# Altium project c-mote.PrjPcb
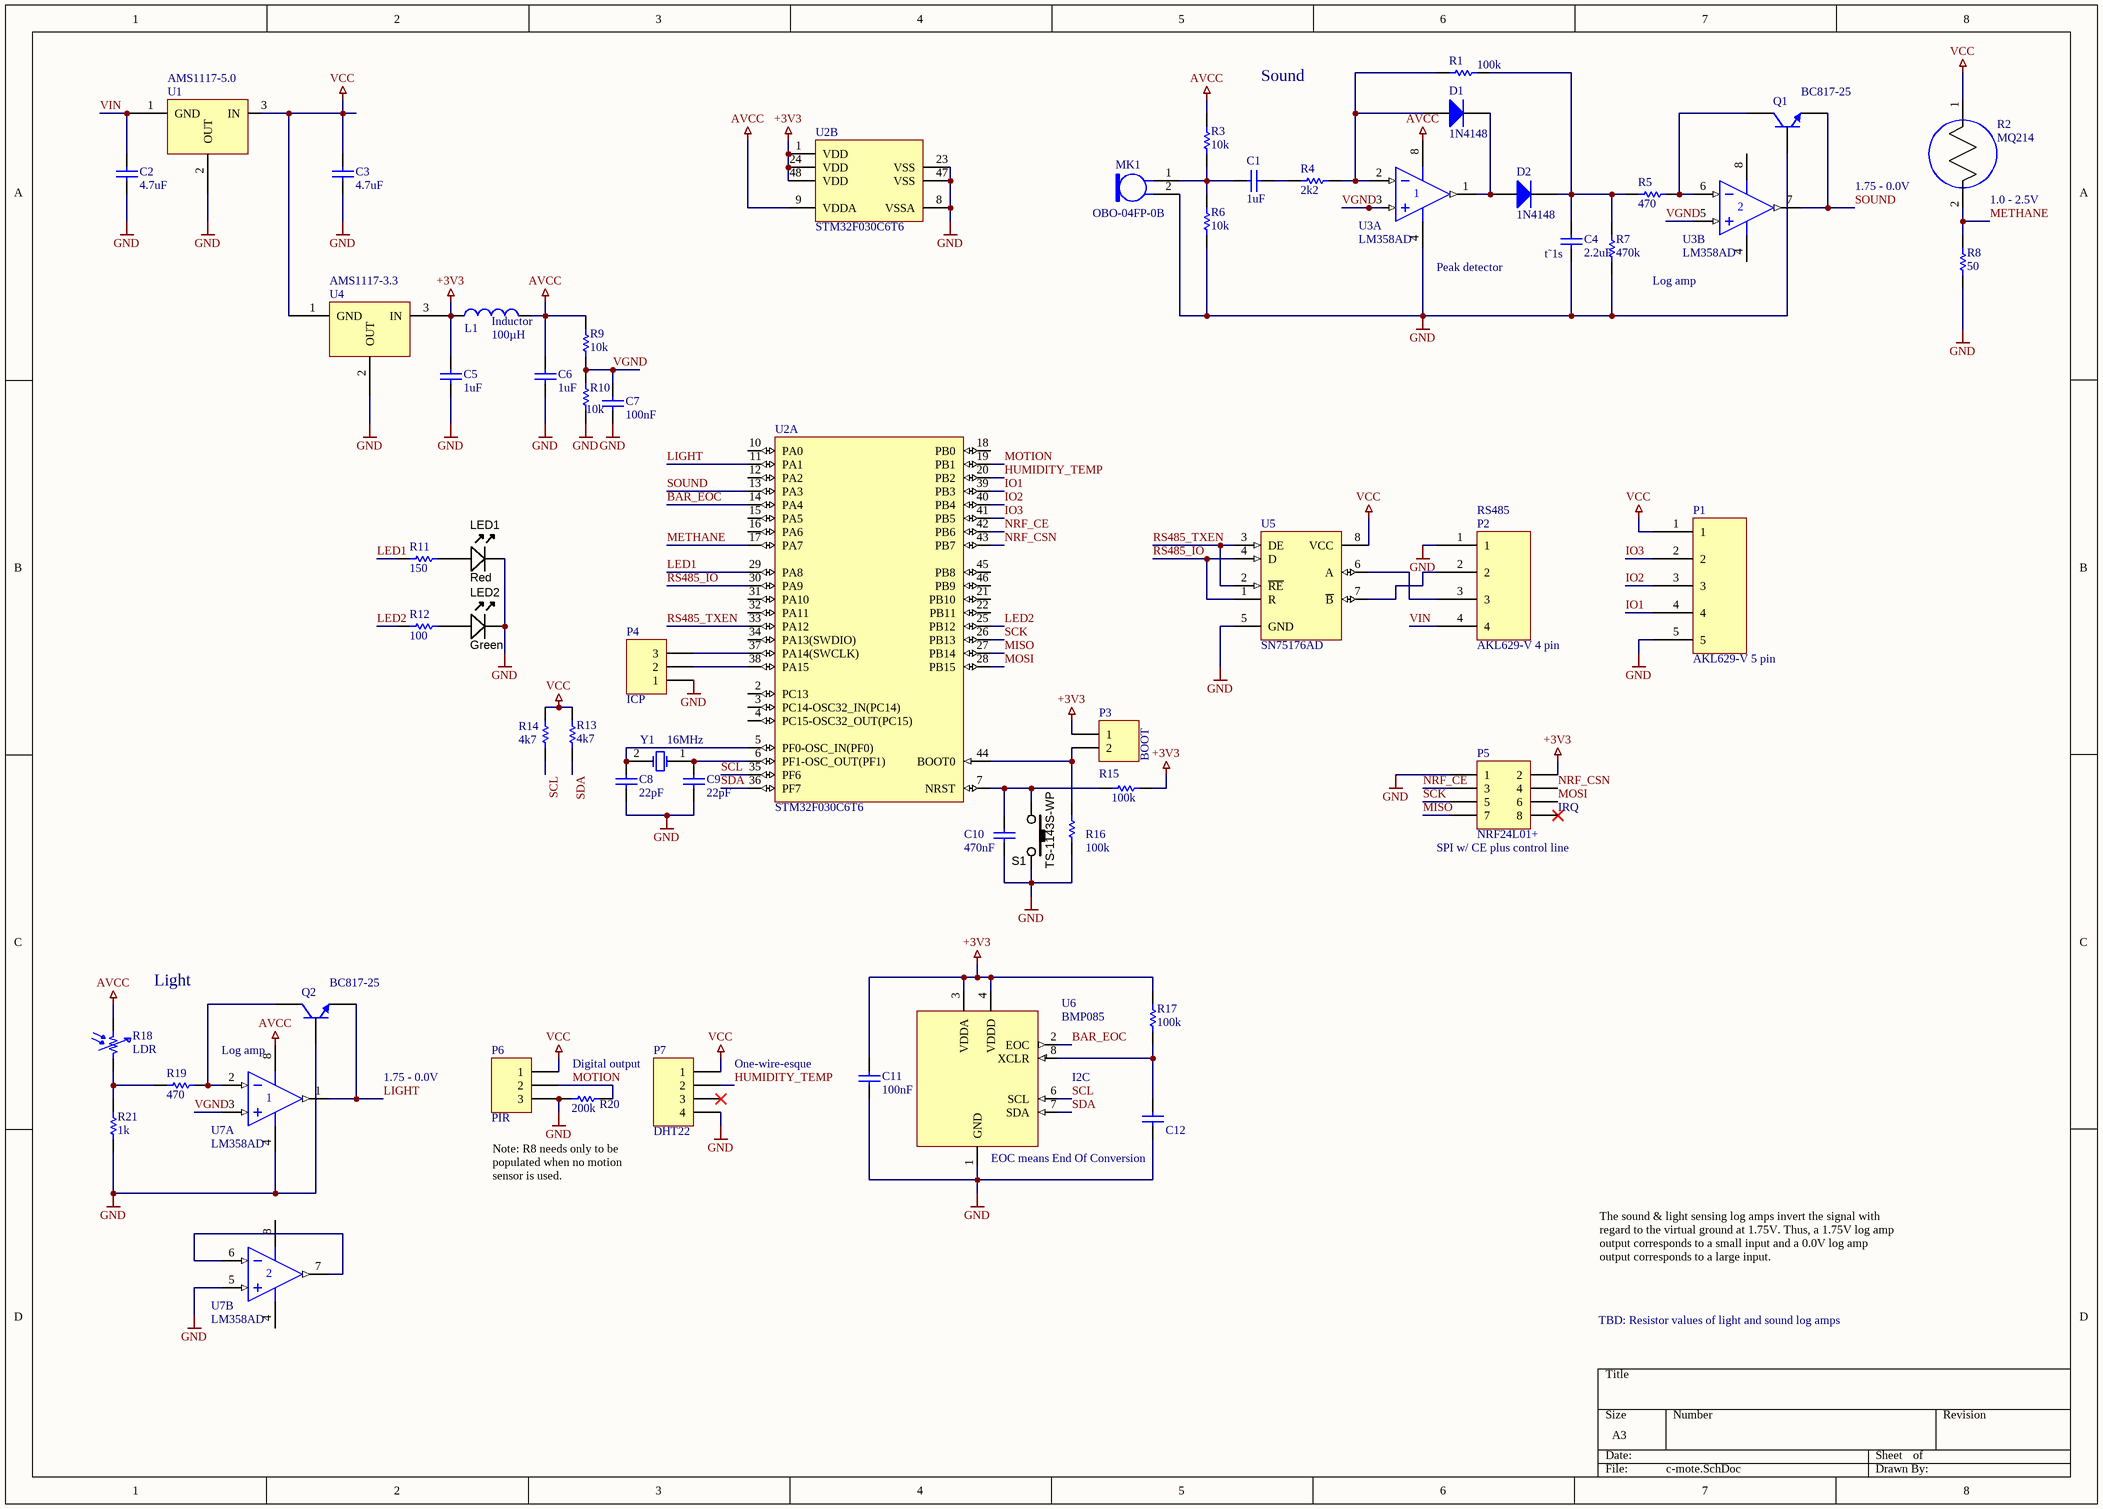
[diagram p0: c-mote.SchDoc]
1 sheet, 57 parts. Net scope: global (net labels, ports and power ports of the same name join across sheets).
Board file: c-mote.PcbDoc

## Sheet c-mote.SchDoc
size A3

### Parts
C1  value 1uF  [CAPC0805(2012)145_M]  (hidden comment: CAP 1uF 10V 0805(2012))
C2  value 4.7uF  [CAPC0805(2012)145_N]  (hidden comment: CAP 4.7uF 10V 0805(2012))
C3  value 4.7uF  [CAPC0805(2012)145_N]  (hidden comment: CAP 4.7uF 10V 0805(2012))
C4  value 2.2uF  [CAPC0805(2012)145_N]  (hidden comment: CAP 2.2uF 10V 0805(2012))
C5  value 1uF  [CAPC0805(2012)145_M]  (hidden comment: CAP 1uF 10V 0805(2012))
C6  value 1uF  [CAPC0805(2012)145_M]  (hidden comment: CAP 1uF 10V 0805(2012))
C7  value 100nF  [CAPC0805(2012)100_M]  (hidden comment: CAP 100nF 10V 0805(2012))
C8  value 22pF  [CAPC0805(2012)100_M]  (hidden comment: CAP 22pF 10V 0805(2012))
C9  value 22pF  [CAPC0805(2012)100_M]  (hidden comment: CAP 22pF 10V 0805(2012))
C10  value 470nF  [CAPC0805(2012)145_M]  (hidden comment: CAP 470nF 10V 0805(2012))
C11  value 100nF  [CAPC0805(2012)100_M]  (hidden comment: CAP 100nF 10V 0805(2012))
C12  CAP 10nF 10V 0805(2012)  [CAPC0805(2012)100_L]  (value not drawn)
D1  1N4148  [SOD-323F]
D2  1N4148  [SOD-323F]
L1  Inductor  value 100µH  [INDC3216]
LED1  Color: Red  [LED-0805-K]
LED2  Color: Green  [LED-0805-K]
MK1  OBO-04FP-0B  [OBO-04FP-0B]
P1  AKL629-V 5 pin
P2  AKL629-V 4 pin
P3  BOOT  [HDR1X2]
P4  ICP  [HDR1X3]
P5  NRF24L01+  [HDR2X4]
P6  PIR  [China-PIR sensor]
P7  DHT22  [DHT22-H]
Q1  BC817-25  [SOT23_N]
Q2  BC817-25  [SOT23_N]
R1  100k  [6-0805]
R2  MQ214  [MQ214]
R3  10k  [6-0805]
R4  2k2  [6-0805]
R5  470  [6-0805]
R6  10k  [6-0805]
R7  470k  [6-0805]
R8  50  [6-0805]
R9  10k  [6-0805]
R10  10k  [6-0805]
R11  150  [6-0805]
R12  100  [6-0805]
R13  4k7  [6-0805]
R14  4k7  [6-0805]
R15  100k  [6-0805]
R16  100k  [6-0805]
R17  100k  [6-0805]
R18  LDR  [KE-10720]
R19  470  [6-0805]
R20  200k  [6-0805]
R21  1k  [6-0805]
S1  TS-1143S-WP  [TS-1143S]
U1  AMS1117-5.0  [SOT223]
U2  STM32F030C6T6  [STM-LQFP48_N]  (parts A,B of 2)
U3  LM358AD  [SOIC127P600X175-8AN]  (parts A,B of 2)
U4  AMS1117-3.3  [SOT223]
U5  SN75176AD  [SOIC127P600X175-8AN]
U6  BMP085  [BMP085]
U7  LM358AD  [SOIC127P600X175-8AN]  (parts A,B of 2)
Y1  16MHz  [HC49/US]

### Nets
+3V3: C5.2 C11.2 L1.1 P3.1 P5.2 R15.2 R17.2 U2.1(VDD) U2.24(VDD) U2.48(VDD) U4.3(IN) U6.3(VDDA) U6.4(VDDD)
AVCC: C6.2 L1.2 R3.2 R9.2 R18.1 U2.9(VDDA) U3.8(V+) U7.8(V+)
GND: C2.1 C3.1 C4.1 C5.1 C6.1 C7.1 C8.1 C9.1 C10.1 C11.1 C12.1 LED1.K LED2.K MK1.2 P1.5 P2.1 P4.1 P5.1 P6.3 P7.4 Q1.1(B) Q2.1(B) R6.1 R7.2 R8.1 R10.1 R16.1 R20.1 R21.2 S1.2 U1.2(OUT) U2.8(VSSA) U2.23(VSS) U2.47(VSS) U3.4(V-) U4.2(OUT) U5.5(GND) U6.1(GND) U7.4(V-) U7.5(IN+)
VCC: C3.2 P1.1 P6.1 P7.1 R2.1 R13.1 R14.1 U1.3(IN) U4.1(GND) U5.8(VCC)
BAR_EOC: U2.14(PA4) U6.2(EOC)
HUMIDITY_TEMP: P7.2 U2.20(PB2)
IO1: P1.4 U2.39(PB3)
IO2: P1.3 U2.40(PB4)
IO3: P1.2 U2.41(PB5)
LED1: R11.2 U2.29(PA8)
LED2: R12.2 U2.25(PB12)
LIGHT: Q2.2(E) U2.11(PA1) U7.1(OUT)
METHANE: R2.2 R8.2 U2.17(PA7)
MISO: P5.7 U2.27(PB14)
MOSI: P5.6 U2.28(PB15)
MOTION: P6.2 R20.2 U2.19(PB1)
NRF_CE: P5.3 U2.42(PB6)
NRF_CSN: P5.4 U2.43(PB7)
RS485_IO: U2.30(PA9) U5.1(R) U5.4(D)
RS485_TXEN: U2.33(PA12) U5.2(~{RE}) U5.3(DE)
SCK: P5.5 U2.26(PB13)
SCL: R14.2 U2.35(PF6) U6.6(SCL)
SDA: R13.2 U2.36(PF7) U6.7(SDA)
SOUND: Q1.2(E) U2.13(PA3) U3.7(OUT)
VGND: C7.2 R9.1 R10.2 U3.3(IN+) U3.5(IN+) U7.3(IN+)
VIN: C2.2 P2.4 U1.1(GND)
NetC1_1: C1.1 R4.2
NetC1_2: C1.2 MK1.1 R3.1 R6.2
NetC4_2: C4.2 D2.2(K) R1.1 R5.1 R7.1
NetC8_2: C8.2 U2.5(PF0-OSC_IN(PF0)) Y1.2(OSC2)
NetC9_2: C9.2 U2.6(PF1-OSC_OUT(PF1)) Y1.1(OSC1)
NetC10_2: C10.2 R15.1 S1.1 U2.7(NRST)
NetC12_2: C12.2 R17.1 U6.8(XCLR)
NetD1_1: D1.1(A) R1.2 R4.1 U3.2(IN-)
NetD1_2: D1.2(K) D2.1(A) U3.1(OUT)
NetLED1_A: LED1.A R11.1
NetLED2_A: LED2.A R12.1
NetP2_2: P2.2 U5.7(~{B})
NetP2_3: P2.3 U5.6(A)
NetP3_2: P3.2 R16.2 U2.44(BOOT0)
NetP4_2: P4.2 U2.38(PA15)
NetP4_3: P4.3 U2.37(PA14(SWCLK))
NetQ1_3: Q1.3(C) R5.2 U3.6(IN-)
NetQ2_3: Q2.3(C) R19.2 U7.2(IN-)
NetR18_2: R18.2 R19.1 R21.1
NetU7_6: U7.6(IN-) U7.7(OUT)

Not connected (* = marked no-connect by the designer): P5 8*; P7 3*; U2 2(PC13) 3(PC14-OSC32_IN(PC14)) 4(PC15-OSC32_OUT(PC15)) 10(PA0) 12(PA2) 15(PA5) 16(PA6) 18(PB0) 21(PB10) 22(PB11) 31(PA10) 32(PA11) 34(PA13(SWDIO)) 45(PB8) 46(PB9)

### Notes on the sheet
- Sound
- (near R2) 1.75 - 0.0V
- (near R2) 1.0 - 2.5V
- Peak detector
- (near C4) t˜1s
- Log amp
- (near P2) RS485
- (near P5) SPI w/ CE plus control line
- (near P5) IRQ
- Light
- (near U7) Log amp
- 1.75 - 0.0V
- Digital output
- One-wire-esque
- (near U6) I2C
- (near U6) EOC means End Of Conversion
- Note: R8 needs only to be populated when no motion sensor is used.
- TBD: Resistor values of light and sound log amps
- The sound & light sensing log amps invert the signal with regard to the virtual ground at 1.75V. Thus, a 1.75V log amp output corresponds to a small input and a 0.0V log amp output corresponds to a large input.

### Library data of the parts
C1 C5 C6 = CMP-1036-04740-1: CAP 1uF 10V ±20% 0805 (2012 Metric) Thickness 1.45mm SMD; Case-Metric: 2012; Case-EIA: 0805; Technology: SMT; Rated Voltage: 10 V; Tolerance: ±20%; Max Thickness: 1.45 mm
C2 C3 = CMP-1036-04884-1: CAP 4.7uF 10V ±20% 0805 (2012 Metric) Thickness 1.45mm SMD; Case-EIA: 0805; Case-Metric: 2012; Rated Voltage: 10 V; Technology: SMT; Tolerance: ±20%; Max Thickness: 1.45 mm
C4 = CMP-1036-04824-1: CAP 2.2uF 10V ±10% 0805 (2012 Metric) Thickness 1.45mm SMD; Case-Metric: 2012; Case-EIA: 0805; Max Thickness: 1.45 mm; Tolerance: ±10%; Technology: SMT; Rated Voltage: 10 V
C7 C11 = CMP-1036-04394-1: CAP 100nF 10V ±10% 0805 (2012 Metric) Thickness 1mm SMD; Case-EIA: 0805; Case-Metric: 2012; Tolerance: ±10%; Max Thickness: 1 mm; Technology: SMT; Rated Voltage: 10 V
C8 C9 = CMP-1036-01210-1: CAP 22pF 10V ±5% 0805 (2012 Metric) Thickness 1mm SMD; Case-EIA: 0805; Case-Metric: 2012; Max Thickness: 1 mm; Rated Voltage: 10 V; Tolerance: ±5%; Technology: SMT
C10 = CMP-1036-04631-1: CAP 470nF 10V ±10% 0805 (2012 Metric) Thickness 1.45mm SMD; Case-EIA: 0805; Case-Metric: 2012; Max Thickness: 1.45 mm; Rated Voltage: 10 V; Technology: SMT; Tolerance: ±10%
C12 = CMP-1036-03809-1: CAP 10nF 10V ±10% 0805 (2012 Metric) Thickness 1mm SMD; Case-EIA: 0805; Case-Metric: 2012; Rated Voltage: 10 V; Tolerance: ±10%; Value: 10nF; Technology: SMT; Max Thickness: 1 mm
D1 D2 = 1N4148: High Conductance Fast Diode; Published: 8-Jun-2000; LatestRevisionDate: 17-Jul-2002; LatestRevisionNote: Re-released for DXP Platform.; DatasheetDocument: 1997; PackageReference: DO-35; Publisher: Altium Limited; Code_JEDEC: DO-204-AH; ComponentLink1Description: Manufacturer Link; ComponentLink1URL: http://www.fairchildsemi.com/; ComponentLink2Description: Datasheet; ComponentLink2URL: http://www.fairchildsemi.com/ds/1N%2F1N4148.pdf
L1 = Inductor: Code_IEC: 1005; Published: 8-Jun-2000; LatestRevisionDate: 29-May-2009; LatestRevisionNote: IPC-7351 Footprint Added.; PackageReference: 0402-A; Publisher: Altium Limited; PackageDescription: Chip Inductor; Code_JEITA: 0402
LED1 = LED_SMD_Red_0805_6mcd: LED 0805 SMD Red 6mcd 621nm; Manufacturer 1: Lite-On Inc; Manufacturer Part Number 1: LTST-C171EKT; Material: GaAsP on GaP; Ratings: 6 mcd; 621 nm; SCDType: source; Package / Case: 0805; Supplier 1: Digi-Key; Supplier Part Number 1: 160-1422-1-ND; Value: Red
LED2 = LED_SMD_Green_0805_6mcd: LED, 0805 SMD, Green; Manufacturer 1: LITE-ON; Manufacturer Part Number 1: LTST-C171GKT; Material: GaP; Ratings: 6 mcd; 569 nm; SCDType: source; Package / Case: 0805; Supplier 1: Digi-Key; Supplier Part Number 1: 160-1423-1-ND; Value: Green
MK1 = Mic2: Microphone; Published: 24-Mar-1999; LatestRevisionDate: 17-Jul-2002; LatestRevisionNote: Re-released for DXP Platform.; PackageReference: PIN2; Publisher: Altium Limited
P3 = Header 2: Header, 2-Pin; LatestRevisionDate: 17-Jul-2002; LatestRevisionNote: Re-released for DXP Platform.; Publisher: Altium Limited
P4 P6 = Header 3: Header, 3-Pin; LatestRevisionDate: 17-Jul-2002; LatestRevisionNote: Re-released for DXP Platform.; Publisher: Altium Limited
P5 = Header 4X2: Header, 4-Pin, Dual row; LatestRevisionDate: 17-Jul-2002; LatestRevisionNote: Re-released for DXP Platform.; Publisher: Altium Limited
P7 = Header 4: Header, 4-Pin; LatestRevisionDate: 17-Jul-2002; LatestRevisionNote: Re-released for DXP Platform.; Publisher: Altium Limited
Q1 Q2 = BC817-25: NPN General Purpose Amplifier; Published: 8-Jun-2000; LatestRevisionDate: 20-Nov-2009; LatestRevisionNote: IPC-7351 Footprint Added.; DatasheetVersion: 1997; PackageVersion: Sep-1998; PackageReference: SOT-23A; Publisher: Altium Limited; PackageDescription: 3-Pin SOT-23 Package 0.95 mm Pitch, 2.3 mm Lead Span; ComponentLink1Description: Manufacturer Link; ComponentLink1URL: http://www.fairchildsemi.com/; ComponentLink2Description: Discontinuation Notice; ComponentLink2URL: http://www.fairchildsemi.com/obsolete/obs.jsp
R1 R3-R17 R19-R21 = ERJ6RB: Precision Thick Film Chip Resistor, 10 Ohm to 1M Ohm Range, 1% and 0.5% Tolerance, 0805 Size, 0.1 W; Published: 17-Dec-2003; LatestRevisionDate: 19-Mar-2004; LatestRevisionNote: Silkscreen size reduced.; PackageDocument: Mar-2003; PackageReference: 6-0805; Publisher: Altium Limited; Code_IPC: 2012 [0805]; ComponentLink1Description: Manufacturer Link; ComponentLink1URL: http://www.panasonic.com/industrial/components/resistive_products.htm; ComponentLink2Description: Datasheet; ComponentLink2URL: http://www.panasonic.com/industrial/components/pdf/AOA0000CE2.pdf
R18 = LDR: KE-10720
S1 = SW_SMD_PB_4.3mm: Switch SMD Tact 4.3mm Stem; Manufacturer 1: Bond-Tact; Manufacturer Part Number 1: TS-1143S-WP-200; SCDType: spec; Package / Case: 6.5x6.5mm; 4.3mm stem
U1 U4 = AMS1117
U2 = CMP-0304-00027-2: ARM Cortex-M0 32-bit MCU, 32 KB Flash, 4 KB Internal RAM, 39 I/Os, 48-pin LQFP, -40 to 85 degC, Tray; Internal RAM Size (kB): 4; Supply Voltage(Vcc) min (V): 2.4; Operating Frequency(F) (Processor speed) (MHz): 48; FLASH Size (Prog) (kB): 32; I/Os (High Current): 39; ComponentLink2URL: http://www.st.com/st-web-ui/static/active/en/resource/technical/document/datasheet/DM00088500.pdf; Mounting Technology: Surface Mount; ComponentLink3URL: http://www.st.com/st-web-ui/static/active/en/resource/technical/document/datasheet/DM00058181.pdf; ComponentLink3Description: Package Specification; ComponentLink1Description: Manufacturer URL; Packing: Tray; PackageVersion: Rev. 6, 06/2013; PartNumber: STM32F030C6T6; Core: ARM Cortex-M0; PackageDescription: 48-Pin Low Profile Quad Flat Package, 7 x 7 mm Body, 0.5 mm Pitch; ComponentLink1URL: http://www.st.com/web/en/home.html; ComponentLink2Description: Datasheet; PackageReference: LQFP48; DatasheetVersion: Rev. 1
U3 U7 = LM358AD: Dual Operational Amplifier; Published: 15-Apr-2002; LatestRevisionDate: 13-Apr-2006; LatestRevisionNote: IPC-7351 Footprint Added.; DatasheetVersion: Aug-1988; PackageVersion: Jan-1998; PackageReference: D008; Publisher: Altium Limited; PackageDescription: 8-Pin Small Outline Integrated Circuit 1.27 mm Pitch; Code_IPC: SOIC127P600-8; ComponentLink1Description: Manufacturer Link; ComponentLink1URL: http://www.ti.com/; ComponentLink2Description: Datasheet; ComponentLink2URL: http://www-s.ti.com/sc/ds/lm358.pdf
U5 = SN75176AD: Differential Bus Transceiver; Note: Receiver Hysteresis of 50mV Typical; Published: 15-May-2002; LatestRevisionDate: 13-Apr-2006; LatestRevisionNote: IPC-7351 Footprint Added.; DatasheetVersion: Aug-1989; PackageVersion: Jan-1998; PackageReference: D008; Publisher: Altium Limited; PackageDescription: 8-Pin Small Outline Integrated Circuit 1.27 mm Pitch; Code_IPC: SOIC127P600-8; ComponentLink1Description: Manufacturer Link; ComponentLink1URL: http://www.ti.com/; ComponentLink2Description: Datasheet; ComponentLink2URL: http://www-s.ti.com/sc/ds/sn75176a.pdf
Y1 = XTAL: Crystal; Published: 8-Jun-2000; LatestRevisionDate: 17-Jul-2002; LatestRevisionNote: Re-released for DXP Platform.; PackageReference: R38; Publisher: Altium Limited; PackageDescription: Crystal, Thru-Hole; 2 Leads; Body 3.1 x 8.2 mm (Dia.xH)